# Altium schematic sheet Digital Isolation.SchDoc
size A4
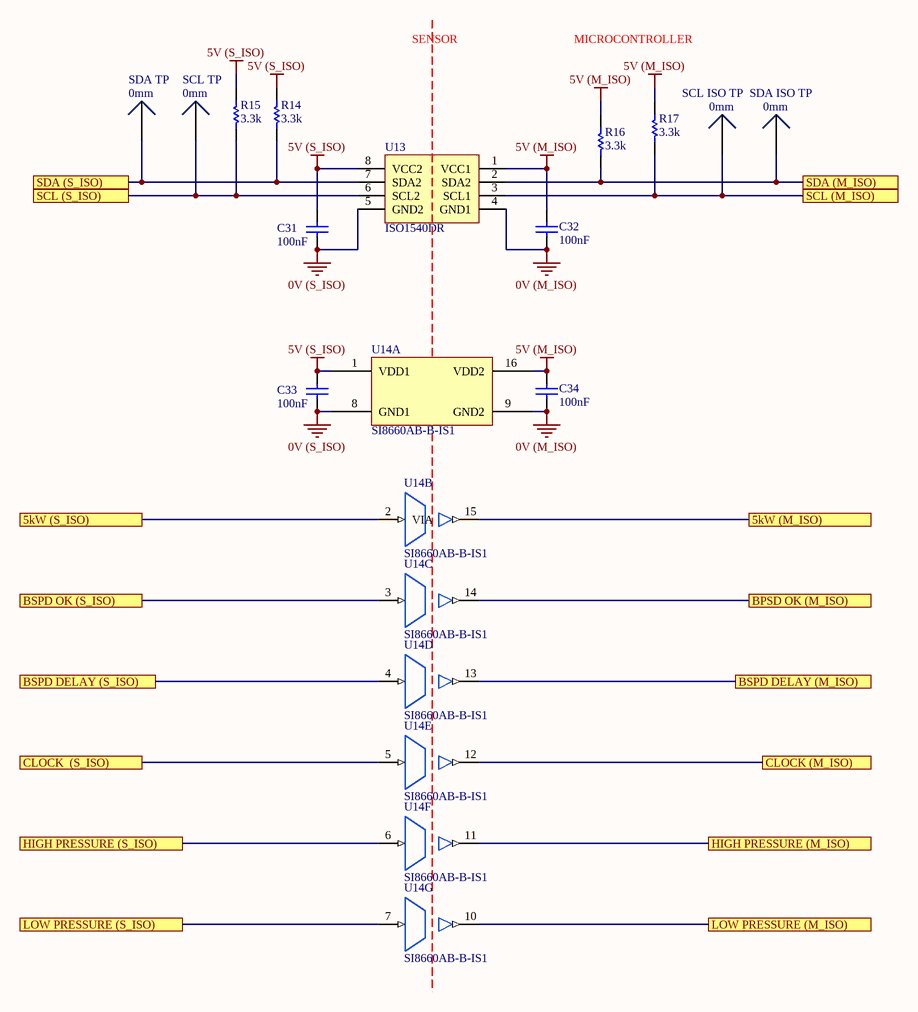
[diagram p0: Digital Isolation.SchDoc]

## Parts
C31  100nF  [0805]
C32  100nF  [0805]
C33  100nF  [0805]
C34  100nF  [0805]
R14  3.3k  [0805]
R15  3.3k  [0805]
R16  3.3k  [0805]
R17  3.3k  [0805]
SCL_ISO_TP  0mm  [SMD Test Point]
SCL_TP  0mm  [SMD Test Point]
SDA_ISO_TP  0mm  [SMD Test Point]
SDA_TP  0mm  [SMD Test Point]
U13  ISO1540DR  [TI 8-SOIC]
U14  SI8660AB-B-IS1  [AD 16-SOIC]  (parts A,B,C,D,E,F,G of 7)

## Ports
5kW (M_ISO), 5kW (S_ISO), BPSD OK (M_ISO), BSPD DELAY (M_ISO), BSPD DELAY (S_ISO), BSPD OK (S_ISO), CLOCK  (S_ISO), CLOCK (M_ISO), HIGH PRESSURE (M_ISO), HIGH PRESSURE (S_ISO), LOW PRESSURE (M_ISO), LOW PRESSURE (S_ISO), SCL (M_ISO), SCL (S_ISO), SDA (M_ISO), SDA (S_ISO)

## Nets
0V (M_ISO): C32.1 C34.1 U13.4(GND1) U14.9(GND2)
0V (S_ISO): C31.1 C33.1 U13.5(GND2) U14.8(GND1)
5V (M_ISO): C32.2 C34.2 R16.2 R17.2 U13.1(VCC1) U14.16(VDD2)
5V (S_ISO): C31.2 C33.2 R14.2 R15.2 U13.8(VCC2) U14.1(VDD1)
5kW (M_ISO): U14.15(VOA) ; port 5kW (M_ISO)
5kW (S_ISO): U14.2(VIA) ; port 5kW (S_ISO)
BPSD OK (M_ISO): U14.14(VOB) ; port BPSD OK (M_ISO)
BSPD DELAY (M_ISO): U14.13(VOC) ; port BSPD DELAY (M_ISO)
BSPD DELAY (S_ISO): U14.4(VIC) ; port BSPD DELAY (S_ISO)
BSPD OK (S_ISO): U14.3(VIB) ; port BSPD OK (S_ISO)
CLOCK  (S_ISO): U14.5(VID) ; port CLOCK  (S_ISO)
CLOCK (M_ISO): U14.12(VOD) ; port CLOCK (M_ISO)
HIGH PRESSURE (M_ISO): U14.11(VOD) ; port HIGH PRESSURE (M_ISO)
HIGH PRESSURE (S_ISO): U14.6(VID) ; port HIGH PRESSURE (S_ISO)
LOW PRESSURE (M_ISO): U14.10(VOD) ; port LOW PRESSURE (M_ISO)
LOW PRESSURE (S_ISO): U14.7(VID) ; port LOW PRESSURE (S_ISO)
SCL (M_ISO): R17.1 SCL_ISO_TP.1 U13.3(SCL1) ; port SCL (M_ISO)
SCL (S_ISO): R15.1 SCL_TP.1 U13.6(SCL2) ; port SCL (S_ISO)
SDA (M_ISO): R16.1 SDA_ISO_TP.1 U13.2(SDA2) ; port SDA (M_ISO)
SDA (S_ISO): R14.1 SDA_TP.1 U13.7(SDA2) ; port SDA (S_ISO)

## Notes on the sheet
- SENSOR
- MICROCONTROLLER

## Library data of the parts
C31-C34 = GCM21BR71E104KA37L: Manufacturer: muRata; Tolerance: 10%; Material: X7R; Rated Voltage: 25V; Part Number: GCM21BR71E104KA37L; Value: 100nF
R14-R17 = RC0805FR073K3L: Manufacturer: YAGEO; Tolerance: 0.01; Rated Voltage: 0.125W; Part Number: RC0805FR073K3L; Value: 3.3k; Material: FR-07
SCL_ISO_TP SCL_TP SDA_ISO_TP SDA_TP = SMD Test Point: Positions: 1; Row Spacing: 0; Flange: No; Contact: NA; Part Number: SMD Test Point; Pitch: 0mm; Angle: 0
U13 = ISO1540DR: I2C Digital Isolator (Multichannel); Manufacturer: Texas Instruments; Part Number: ISO1540DR; Digikey Part Number: 296-34871-1-ND; Digikey Link: https://www.digikey.com/product-detail/en/texas-instruments/ISO1540DR/296-34871-1-ND/3587214
U14 = SI8660AB-B-IS1: General Purpose Digital Isolator 2500Vrms 6 Channel 1Mbps 35kV/µs CMTI 16-SOIC (0.154", 3.90mm Width); Manufacturer: Silicon Labs; Part Number: SI8660AB-B-IS1; Digikey Part Number: 336-4410-ND; Digikey Link: https://www.digikey.com/product-detail/en/silicon-labs/SI8660AB-B-IS1/336-4410-ND/4576756